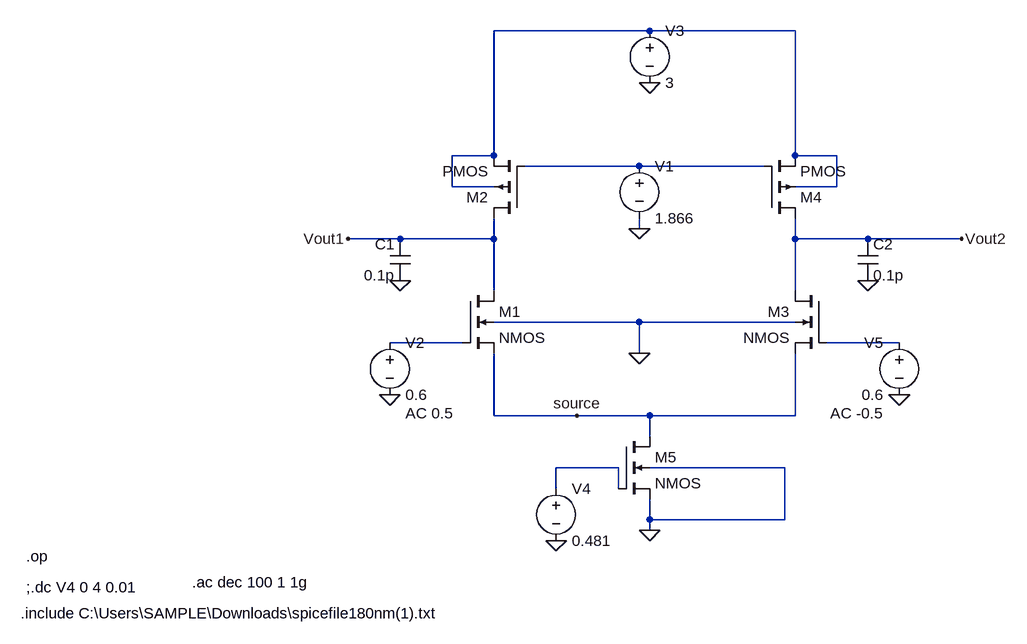
[diagram p0: schematic diff2.asc]
diff2.asc, the LTspice schematic file:
Version 4
SHEET 1 1316 736
WIRE 320 -176 80 -176
WIRE 544 -176 320 -176
WIRE 80 16 80 -176
WIRE 80 16 16 16
WIRE 544 16 544 -176
WIRE 608 16 544 16
WIRE 304 32 128 32
WIRE 496 32 304 32
WIRE 16 64 16 16
WIRE 80 64 16 64
WIRE 608 64 608 16
WIRE 608 64 544 64
WIRE 304 128 304 112
WIRE -64 144 -144 144
WIRE 80 144 80 112
WIRE 80 144 -64 144
WIRE 544 144 544 112
WIRE 656 144 544 144
WIRE 800 144 656 144
WIRE 80 224 80 144
WIRE 544 224 544 144
WIRE 304 272 80 272
WIRE 544 272 304 272
WIRE 32 304 -80 304
WIRE 704 304 592 304
WIRE 304 320 304 272
WIRE 80 416 80 320
WIRE 208 416 80 416
WIRE 320 416 208 416
WIRE 544 416 544 320
WIRE 544 416 320 416
WIRE 320 448 320 416
WIRE 272 496 176 496
WIRE 528 496 320 496
WIRE 176 528 176 496
WIRE 272 528 272 496
WIRE 320 576 320 544
WIRE 528 576 528 496
WIRE 528 576 320 576
WIRE 320 592 320 576
FLAG -80 384 0
FLAG 320 -96 0
FLAG 304 128 0
FLAG 704 384 0
FLAG -144 144 Vout1
FLAG 176 608 0
FLAG 320 592 0
FLAG -64 208 0
FLAG 800 144 Vout2
FLAG 656 208 0
FLAG 208 416 source
FLAG 304 320 0
SYMBOL nmos4 32 224 R0
SYMATTR InstName M1
SYMATTR Value2 l=0.72u w=180u
SYMBOL voltage -80 288 R0
WINDOW 123 24 124 Left 2
WINDOW 39 0 0 Left 0
SYMATTR Value2 AC 0.5
SYMATTR InstName V2
SYMATTR Value 0.6
SYMBOL pmos4 128 112 R180
SYMATTR InstName M2
SYMATTR Value2 l=1.8u w=22.5u
SYMBOL voltage 320 -192 R0
WINDOW 123 0 0 Left 0
WINDOW 39 0 0 Left 0
SYMATTR InstName V3
SYMATTR Value 3
SYMBOL voltage 304 16 R0
WINDOW 123 0 0 Left 0
WINDOW 39 0 0 Left 0
SYMATTR InstName V1
SYMATTR Value 1.866
SYMBOL nmos4 592 224 M0
SYMATTR InstName M3
SYMATTR Value2 l=0.72u w=180u
SYMBOL voltage 704 288 M0
WINDOW 123 24 124 Left 2
WINDOW 39 0 0 Left 0
SYMATTR Value2 AC -0.5
SYMATTR InstName V5
SYMATTR Value 0.6
SYMBOL pmos4 496 112 M180
SYMATTR InstName M4
SYMATTR Value2 l=1.8u w=22.5u
SYMBOL nmos4 272 448 R0
SYMATTR InstName M5
SYMATTR Value2 l=1.8u w=522u
SYMBOL voltage 176 512 R0
WINDOW 123 0 0 Left 0
WINDOW 39 0 0 Left 0
SYMATTR InstName V4
SYMATTR Value 0.481
SYMBOL cap -48 144 M0
SYMATTR InstName C1
SYMATTR Value 0.1p
SYMBOL cap 640 144 R0
SYMATTR InstName C2
SYMATTR Value 0.1p
TEXT -648 720 Left 2 !.include C:\\Users\\SAMPLE\\Downloads\\spicefile180nm(1).txt
TEXT -640 632 Left 2 !.op
TEXT -640 680 Left 2 !;.dc V4 0 4 0.01
TEXT -384 672 Left 2 !.ac dec 100 1 1g

The netlist it stands for:
* diff2.asc
M1 Vout1 N003 source 0 NMOS l=0.72u w=180u
V2 N003 0 0.6 AC 0.5
M2 Vout1 N002 N001 N001 PMOS l=1.8u w=22.5u
V3 N001 0 3
V1 N002 0 1.866
M3 Vout2 N004 source 0 NMOS l=0.72u w=180u
V5 N004 0 0.6 AC -0.5
M4 Vout2 N002 N001 N001 PMOS l=1.8u w=22.5u
M5 source N005 0 0 NMOS l=1.8u w=522u
V4 N005 0 0.481
C1 Vout1 0 0.1p
C2 Vout2 0 0.1p
.model NMOS NMOS
.model PMOS PMOS
.lib standard.mos
.include C:\Users\SAMPLE\Downloads\spicefile180nm(1).txt
.op
;.dc V4 0 4 0.01
.ac dec 100 1 1g
.backanno
.end